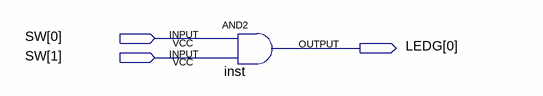
[diagram p0: schematic sheet]
// Quartus schematic test_board.bdf as structural Verilog: 1 symbols, 3 pins
module test_board (
  input  [1:0] SW,
  output [0:0] LEDG
);

  and inst (LEDG[0], SW[0], SW[1]);
endmodule
